# Altium schematic sheet MCU.SchDoc
size A4; SheetNumber: 3; SheetTotal: 3
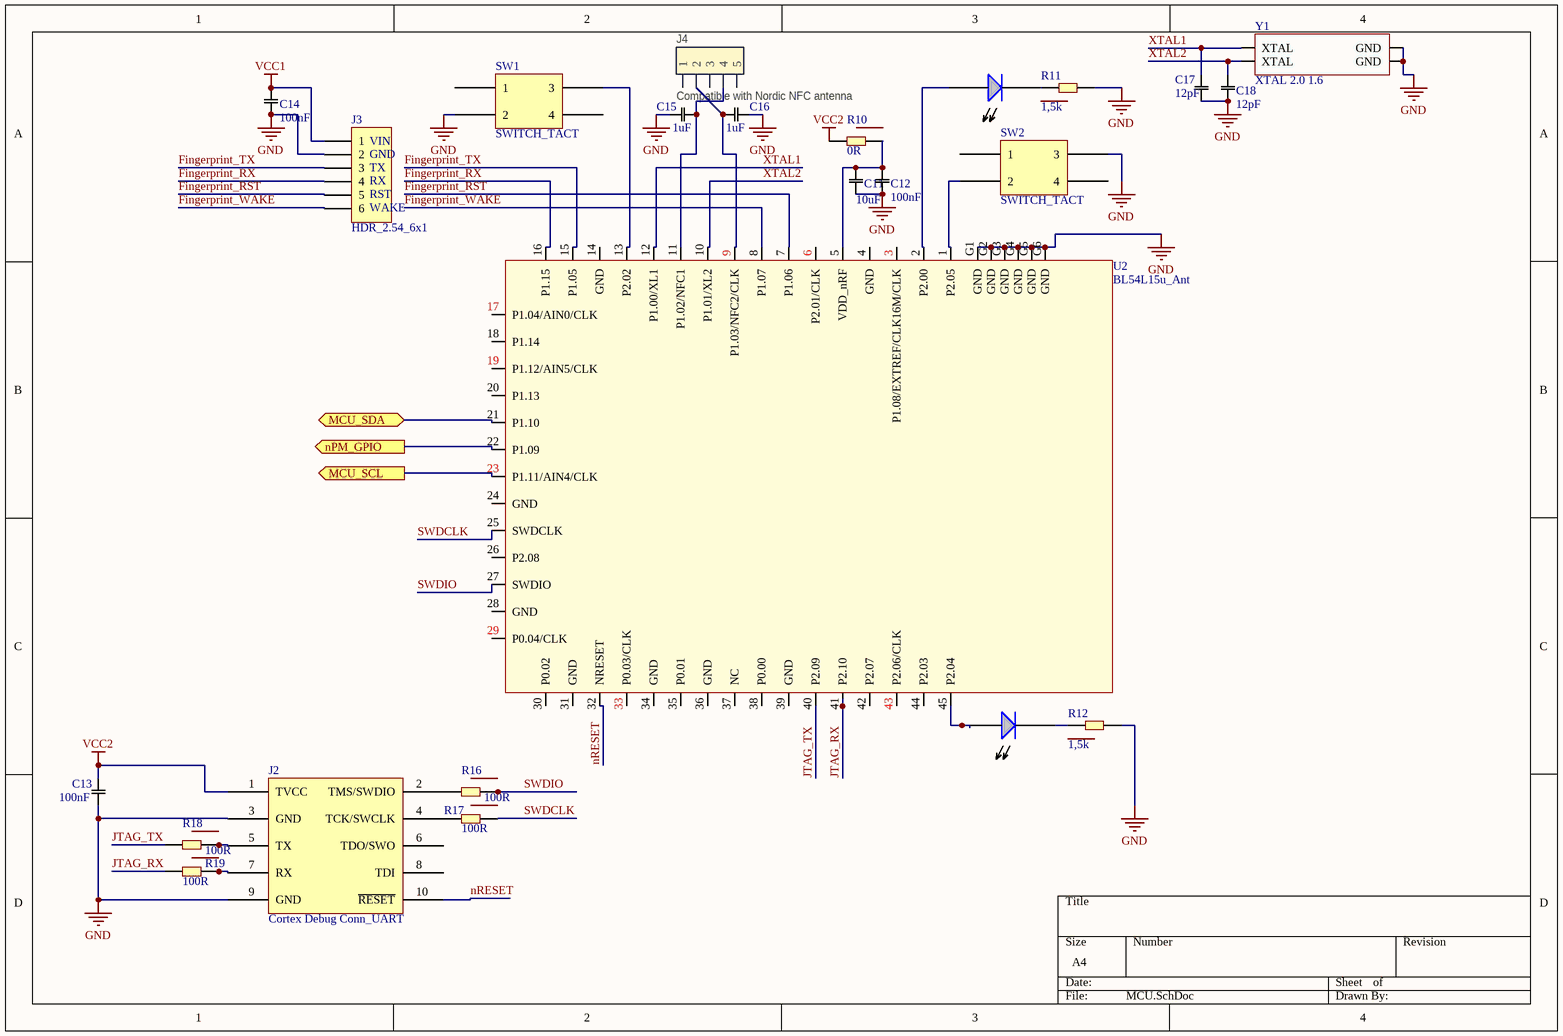
[diagram p0: MCU.SchDoc]

## Parts
C11  10uF  [0402C]
C12  100nF  [0402C]
C13  100nF  [0402C]
C14  100nF  [0402C]
C15  1uF  [0402C]
C16  1uF  [0402C]
C17  12pF  [0402C]
C18  12pF  [0402C]
D11  LED  [0603LED_RED]  (value not drawn)
D12  LED  [0603LED_RED]  (value not drawn)
J2  Cortex Debug Conn_UART  [Cortex Debug Connector - THT]
J3  HDR_2.54_6x1  [HDR 2.54MM 1x6]
J4  Compatible with Nordic NFC antenna  [FPC_05P-0.5mm-RA-SMD]
R10  0R  [0402R]
R11  1,5k  [0402R]
R12  1,5k  [0402R]
R16  100R  [0402R]
R17  100R  [0402R]
R18  100R  [0402R]
R19  100R  [0402R]
SW1  SWITCH_TACT  [TACT - SMD]
SW2  SWITCH_TACT  [TACT - SMD]
U2  BL54L15u_Ant  [Ezurio, BL54L15u Module, Antenna, Platform Side]
Y1  XTAL 2.0 1.6  [XTAL 2.0 1.6]

## Ports
MCU_SCL (out, see Schemat_blokowy[2B]), MCU_SDA (bidir, see Schemat_blokowy[2B]), nPM_GPIO (out, see Schemat_blokowy[2B])

## Nets
GND: C11.2 C12.2 C13.1 C14.1 C15.1 C16.2 C17.2 C18.2 J2.3(GND) J2.9(GND) J3.2 R11.1 R12.1 SW1.2 SW2.3 U2.G1(GND) U2.G2(GND) U2.G3(GND) U2.G4(GND) U2.G5(GND) U2.G6(GND) Y1.2(GND) Y1.4(GND)
VCC1: C14.2 J3.1
VCC2: C13.2 J2.1(TVCC) R10.1
Fingerprint_RST: J3.5 U2.7(P1.06)
Fingerprint_RX: J3.4 U2.16(P1.15)
Fingerprint_TX: J3.3 U2.15(P1.05)
Fingerprint_WAKE: J3.6 U2.8(P1.07)
JTAG_RX: R19.1 U2.41(P2.10)
JTAG_TX: R18.1 U2.40(P2.09)
MCU_SCL: U2.23(P1.11/AIN4/CLK) ; port MCU_SCL
MCU_SDA: U2.21(P1.10) ; port MCU_SDA
nPM_GPIO: U2.22(P1.09) ; port nPM_GPIO
nRESET: J2.10(~{RESET}) U2.32(NRESET)
SWDCLK: R17.2 U2.25(SWDCLK)
SWDIO: R16.2 U2.27(SWDIO)
XTAL1: C17.1 U2.12(P1.00/XL1) Y1.3(XTAL)
XTAL2: C18.1 U2.10(P1.01/XL2) Y1.1(XTAL)
NetC11_1: C11.1 C12.1 R10.2 U2.5(VDD_nRF)
NetC15_2: C15.2 J4.4 U2.11(P1.02/NFC1)
NetC16_1: C16.1 J4.2 U2.9(P1.03/NFC2/CLK)
NetD11_1: D11.1 R11.2
NetD11_2: D11.2 U2.2(P2.00)
NetD12_1: D12.1 R12.2
NetD12_2: D12.2 U2.45(P2.04)
NetJ2_2: J2.2(TMS/SWDIO) R16.1
NetJ2_4: J2.4(TCK/SWCLK) R17.1
NetJ2_5: J2.5(TX) R18.2
NetJ2_7: J2.7(RX) R19.2
NetSW1_3: SW1.3 U2.13(P2.02)
NetSW2_2: SW2.2 U2.1(P2.05)

Not connected (* = marked no-connect by the designer): J2 6(TDO/SWO) 8(TDI); J4 1 3 5; SW1 1 4; SW2 1 4; U2 3(P1.08/EXTREF/CLK16M/CLK) 4(GND) 6(P2.01/CLK) 14(GND) 17(P1.04/AIN0/CLK) 18(P1.14) 19(P1.12/AIN5/CLK) 20(P1.13) 24(GND) 26(P2.08) 28(GND) 29(P0.04/CLK) 30(P0.02) 31(GND) 33(P0.03/CLK) 34(GND) 35(P0.01) 36(GND) 37(NC) 38(P0.00) 39(GND) 42(P2.07) 43(P2.06/CLK) 44(P2.03)

## Notes on the sheet
- (near J3) VIN
- (near J3) GND
- (near J3) TX
- (near J3) RX
- (near J3) RST
- (near J3) WAKE

## Library data of the parts
C11-C18 = C: Capacitor
  C11: Value: 10uF
  C12-C14: Value: 100nF
  C15 C16: Value: 1uF
  C17 C18: Value: 12pF
J2 = Cortex Debug Conn_UART: JTAG10 Connector
J3 = HDR_2.54_6x1: Header 2.54, 6-Pin; LatestRevisionDate: 17-Jul-2002; LatestRevisionNote: Re-released for DXP Platform.; Publisher: Altium Limited
J4 = NFC_CONN: 0.5mm FPC, 5P,Right Angle SMT,Double Contact,H=1.2mm,White, Tin plated; Manufacturer: WCON; Manufacturer Part Number: 5141-05RZDNWR03; Part number NEMS: 100500528; Value: FPC 0.5mm RA SMD; Note: (Replaced 5141-05RZDNWR02); Artikkelnr Noca: N.A.; Pad Count: 7; Component Status: Active; System: Connector; Part Number: FPC_05P-0.5mm-RA-SMD; Footprint Doc: FPC_05P-0.5mm-RA-SMD; LatestRevisionDate: 2024-02-02; Published: 2015-06-22; Part number IPS: N.A.; ComponentLink1URL: N.A.; ComponentLink1Description: Datasheet; ComponentLink2URL: N.A.; ComponentLink2Description: Supplier link; HelpURL: \\hizz\pro\app9717\Datasheet\connectors\W-CON\5141-05RZDNXX02.pdf; Supplier 1: Cabcon; Supplier Part Number 1: 5141-05RZDNWR03; Supplier 2: N.A.; Supplier Part Number 2: N.A.; Component Class: Connectors; PartId: 100500528; Author: rsk; Part number Norautron: N.A.
R10-R12 R16-R19 = R: Resistor
  R10: Value: 0R
  R11 R12: Value: 1,5k
  R16-R19: Value: 100R
SW1 SW2 = SWITCH_TACT: Switch tact
U2 = BL54L15u_Ant: 453-00223_BL54L15u_Chip ANT_SCH_Symbol_Altium
Y1 = XTAL 2.0 1.6: XTAL